# Altium schematic sheet Sheet04.SchDoc
size A4
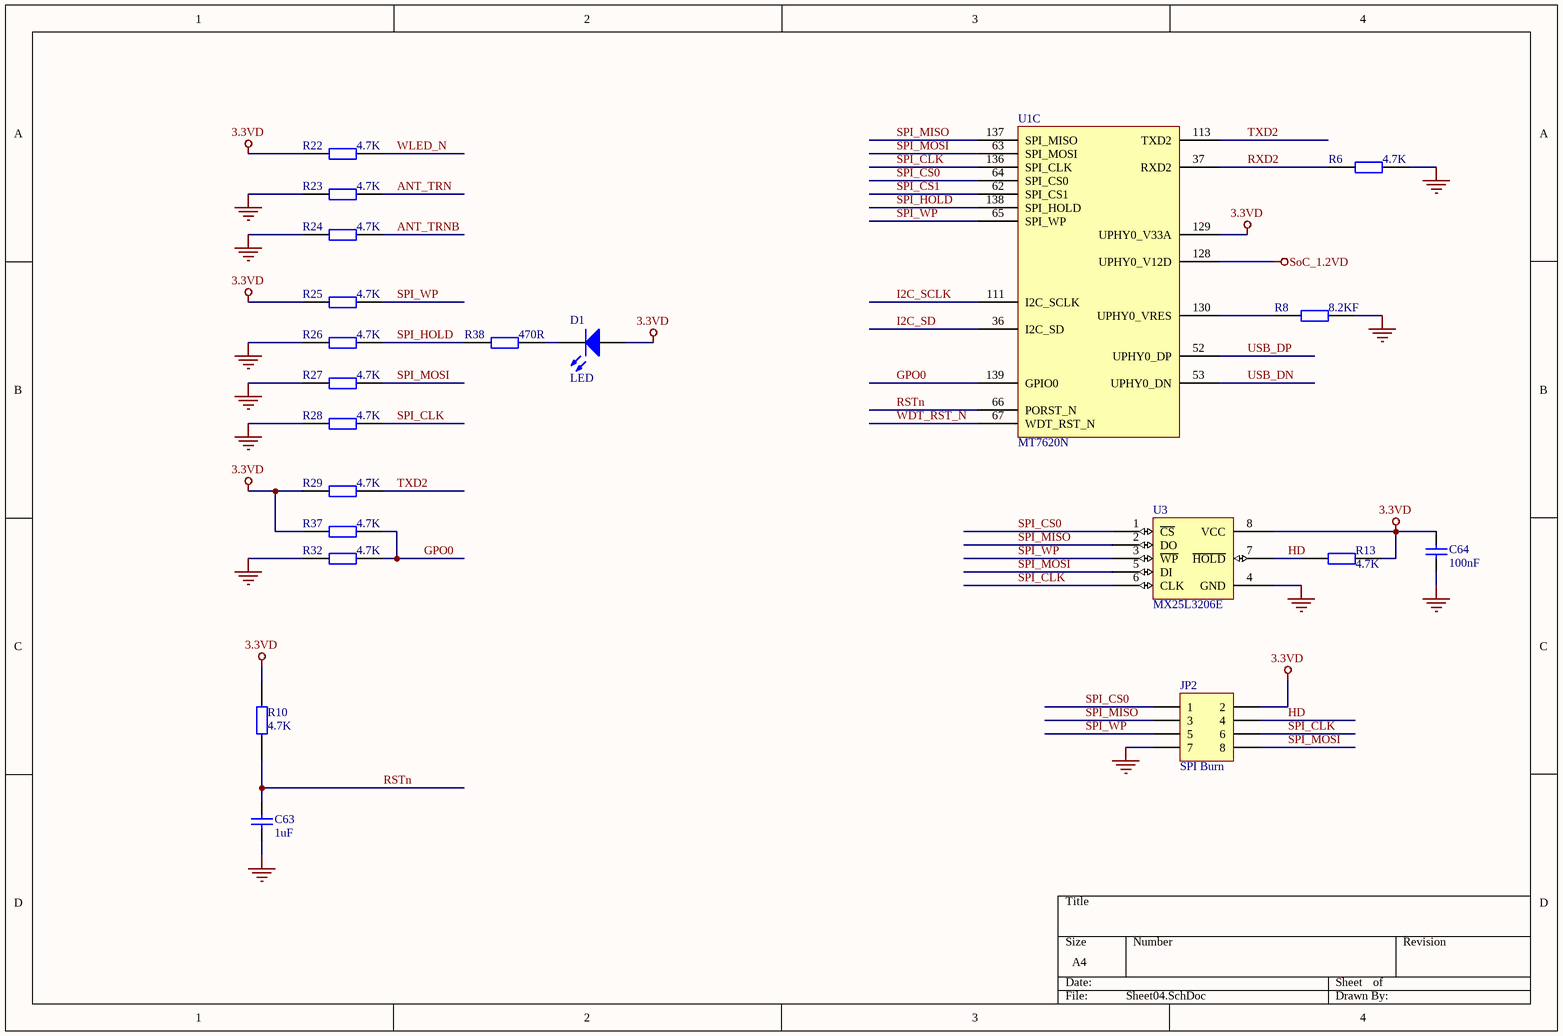
[diagram p0: Sheet04.SchDoc]

## Parts
C63  1uF  [R0402]
C64  100nF  [R0402]
D1  LED  [D0603]
JP2  SPI Burn  [IDC-2X4-2_54_M]
R6  4.7K  [R0402]
R8  8.2KF  [R0402]
R10  4.7K  [R0402]
R13  4.7K  [R0402]
R22  4.7K  [R0402]
R23  4.7K  [R0402]
R24  4.7K  [R0402]
R25  4.7K  [R0402]
R26  4.7K  [R0402]
R27  4.7K  [R0402]
R28  4.7K  [R0402]
R29  4.7K  [R0402]
R32  4.7K  [R0402]
R37  4.7K  [R0402]
R38  470R  [R0402]
U1  MT7620N  [QFN-148-RT]  (part C of 5)
U3  MX25L3206E  [SO-8W]

## Nets
3.3VD: C64.1 D1.1(A) JP2.2 R10.1 R13.1 R22.2 R25.2 R29.2 R37.2 U1.129(UPHY0_V33A) U3.8(VCC)
GND: C63.2 C64.2 JP2.7 R6.1 R8.1 R23.2 R24.2 R26.2 R27.2 R28.2 R32.2 U3.4(GND)
SoC_1.2VD: U1.128(UPHY0_V12D)
ANT_TRN: R23.1
ANT_TRNB: R24.1
GPO0: R32.1 R37.1 U1.139(GPIO0)
HD: JP2.4 R13.2 U3.7(~{HOLD})
I2C_SCLK: U1.111(I2C_SCLK)
I2C_SD: U1.36(I2C_SD)
RSTn: C63.1 R10.2 U1.66(PORST_N)
RXD2: R6.2 U1.37(RXD2)
SPI_CLK: JP2.6 R28.1 U1.136(SPI_CLK) U3.6(CLK)
SPI_CS0: JP2.1 U1.64(SPI_CS0) U3.1(~{CS})
SPI_CS1: U1.62(SPI_CS1)
SPI_HOLD: R26.1 R38.2 U1.138(SPI_HOLD)
SPI_MISO: JP2.3 U1.137(SPI_MISO) U3.2(DO)
SPI_MOSI: JP2.8 R27.1 U1.63(SPI_MOSI) U3.5(DI)
SPI_WP: JP2.5 R25.1 U1.65(SPI_WP) U3.3(~{WP})
TXD2: R29.1 U1.113(TXD2)
USB_DN: U1.53(UPHY0_DN)
USB_DP: U1.52(UPHY0_DP)
WDT_RST_N: U1.67(WDT_RST_N)
WLED_N: R22.1
NetD1_2: D1.2(K) R38.1
NetR8_2: R8.2 U1.130(UPHY0_VRES)

## Library data of the parts
C63 C64 = Cap Semi: 2pF, 50V, +/-0.25pF; Manufacturer: Generic Components; Class: Passive; SubClass: Capacitor; Value: 0.1uF; Published: 08/06/2000; Publisher: Altium Hobart Technology Centre
JP2 = Header 4X2: Header, 4-Pin, Dual row; LatestRevisionDate: 17-Jul-2002; LatestRevisionNote: Re-released for DXP Platform.; Publisher: Altium Limited
R6 R8 R10 R13 R22-R29 R32 R37 R38 = RES
U3 = MX25L3205DM2I